# Altium schematic sheet FTDI.SchDoc
size Letter; CompanyName: UVM AERO; Organization: UVM AERO; Address1: 33 Colchester Ave; Address2: Votey 118; Address3: Philadelpia, PA 19104; Address4: USA
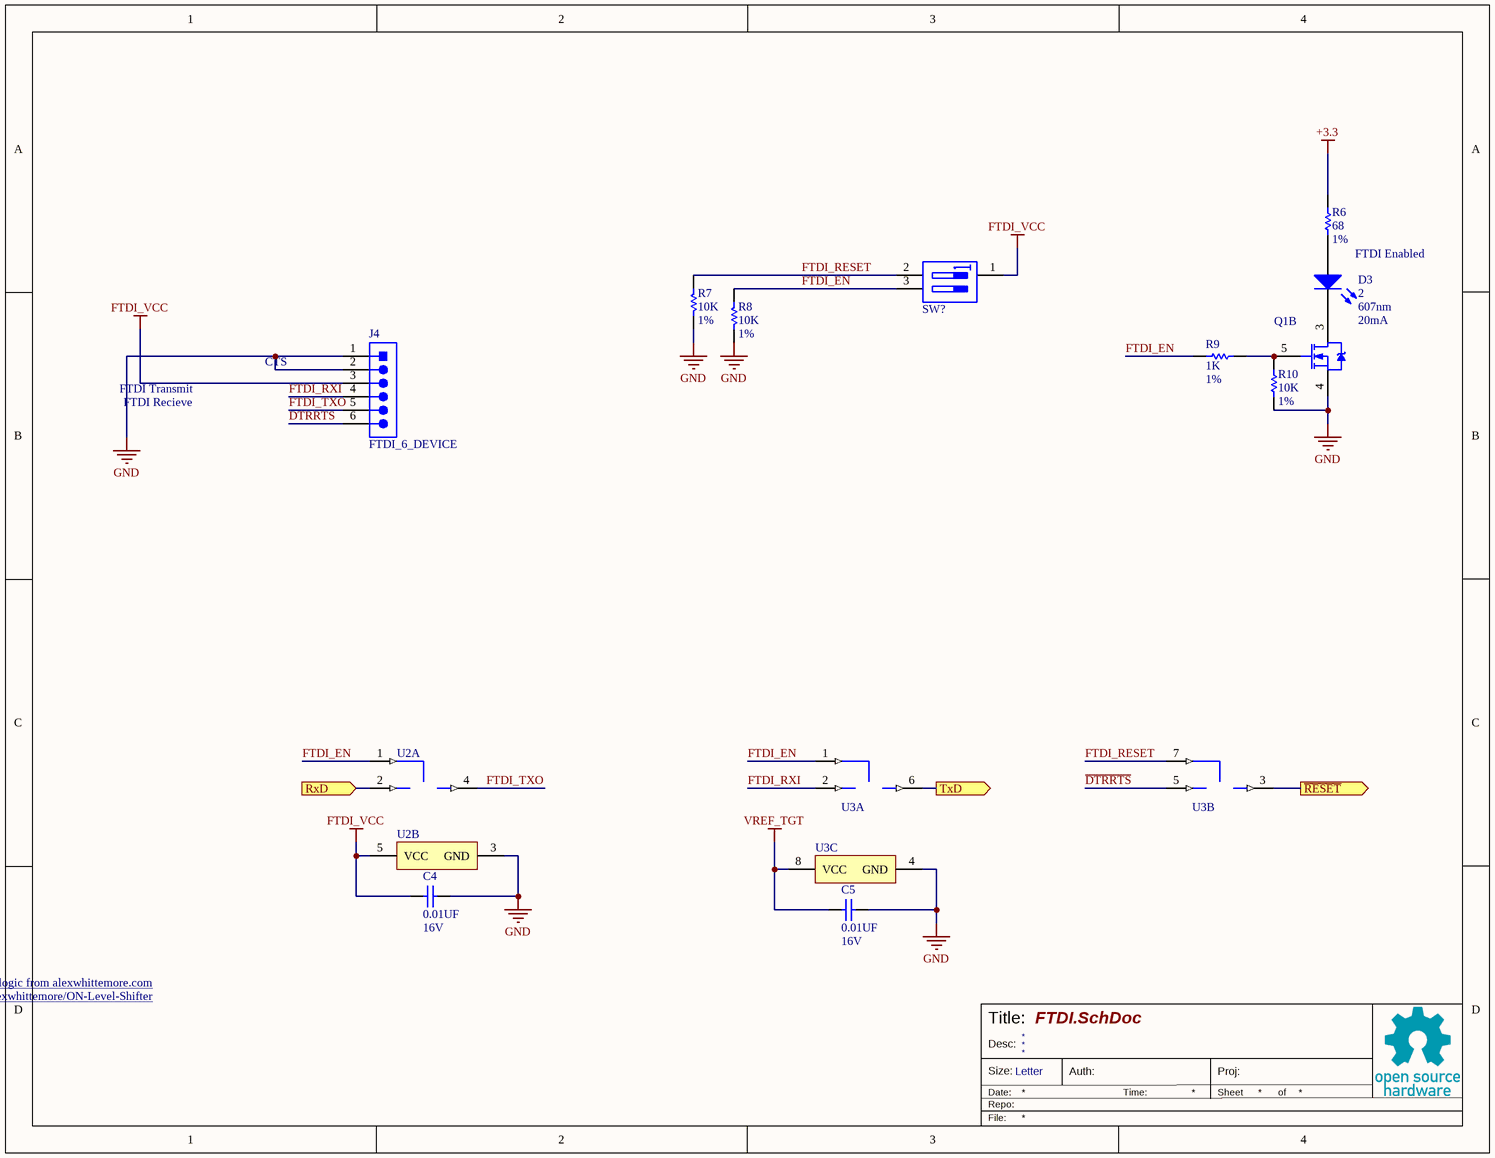
[diagram p0: FTDI.SchDoc]

## Parts
C4  Val: 0.01UF  Vol: 16V  [0603_CAP]  (hidden comment: CAP 0603 0.01UF 16V 10% X7R)
C5  Val: 0.01UF  Vol: 16V  [0603_CAP]  (hidden comment: CAP 0603 0.01UF 16V 10% X7R)
D3  Voltage Rating: 2  Wavelength: 607nm  Test Current: 20mA  [SM0805AC]  (hidden comment: Amber LED)
J4  FTDI_6_DEVICE  [FTDI_6_HDR_TTL-232R]
Q1  Dual N-Ch MOSFET  [SOT363]  (value not drawn)  (part B of 2)
R6  Val: 68  Tol: 1%  [0603_RES]  (hidden comment: RES 0603 68 1%)
R7  Val: 10K  Tol: 1%  [0603_RES]  (hidden comment: RES 0603 10K 1%)
R8  Val: 10K  Tol: 1%  [0603_RES]  (hidden comment: RES 0603 10K 1%)
R9  Val: 1K  Tol: 1%  [0603_RES]  (hidden comment: RES 0603 1K 1%)
R10  Val: 10K  Tol: 1%  [0603_RES]  (hidden comment: RES 0603 10K 1%)
SW?  SWITCH SLIDE DIP SPST 10MA 20V  [SPA02B]  (value not drawn)
U2  Buffer  [SOT353]  (value not drawn)  (parts A,B of 2)
U3  Dual Bus Buffer Gate  [DCU-8]  (value not drawn)  (parts A,B,C of 3)

## Ports
RxD (in), TxD (out), ~{RESET} (out)

## Nets
+3.3: R6.2
FTDI_VCC: C4.2 J4.3(VCC) SW?.1(C) U2.5(VCC)
GND: C4.1 C5.1 J4.1(GND) J4.2(~{CTS_(GND_if_unused)}) Q1.4(S) R7.1 R8.1 R10.1 U2.3(GND) U3.4(GND)
VREF_TGT: C5.2 U3.8(VCC)
~{DTRRTS}: J4.6(RTS_or~{_}DTR_(Often_used_for~{_}RESET)) U3.5(IN2)
~{RESET}: U3.3(OUT2) ; port ~{RESET}
FTDI_EN: R8.2 R9.1 SW?.3(B1) U2.1(EN) U3.1(EN1)
FTDI_RESET: R7.2 SW?.2(A1) U3.7(EN2)
FTDI_RXI: J4.4(RxD) U3.2(IN1)
FTDI_TXO: J4.5(TxD) U2.4(OUT)
RxD: U2.2(IN) ; port RxD
TxD: U3.6(OUT1) ; port TxD
NetD3_A: D3.A R6.1
NetD3_K: D3.K Q1.3(D)
NetQ1_5: Q1.5(G) R9.2 R10.2

## Notes on the sheet
- FTDI Enabled
- CTS
- FTDI Transmit
- FTDI Recieve
- Level shifting logic from alexwhittemore.com <https://www.alexwhittemore.com/on-uart-level-shifter/>
- His Schematic is at github.com/alexwhittemore/ON-Level-Shifter <https://github.com/alexwhittemore/ON-Level-Shifter>
- Title:
- Desc:
- Size:
- Date:
- File:
- Repo:
- Letter
- Auth:
- Time:
- Sheet
- Proj:
- of

## Library data of the parts
C4 C5 = CAP 0603 0.01UF 16V 10% X7R: Capacitor Surface Mount 0603 Footprint 0.01UF 16V 10% Tolerance Ceramic X7R; Manufacturer: Various; PCB Package: 0603; Description in Visual: Cap SMT 0603 0.01UF 16V 10%  Cer X7R; P/N: CAP 0603 0.01UF 16V 10% X7R; Manufacturer P/N: Various; Value: 0.01UF; Voltage: 16V; Tolerance: 10%; Type: Ceramic X7R; ComponentLink1Description: Manufacturer Website; ComponentLink2Description: Component Datasheet; ComponentLink3Description: Octopart Link
D3 = SM0805AC: Amber 607nm LED Indication - Discrete 2V 0805 (2012 Metric); Manufacturer: Bivar; PCB Package: 0805; Configuration: Single; Lens Style: Square; Millicandela Rating: 6mcd; Viewing Angle: 130°; Lens Type: Clear; Package Class: Surface Mount; P/N: SM0805AC; Manufacturer P/N: SM0805AC; Description in Visual: Amber 607nm LED Indication - Discrete 2V 0805 (2012 Metric); Color: Amber; ComponentLink1Description: Manufacturer Website; ComponentLink1URL: #https://www.bivar.com/#; ComponentLink2Description: Component Datasheet; ComponentLink2URL: https://www.bivar.com/parts_content/Datasheets/SM0805AC.pdf; ComponentLink3Description: Octopart Link; ComponentLink3URL: #https://octopart.com/sm0805ac-bivar-5838577?r=sp#Specs
J4 = FTDI_TTL_6PIN: Connector Header Through Hole 6 position 0.100" (2.54mm); Manufacturer: Generic; Manufacturer P/N: Various; Number of Contacts: 6; Gender: Male; P/N: FTDI_TTL_6PIN; Description in Visual: Connector Header Through Hole 6 position 0.100" (2.54mm); Orientation: Vertical; Number of Rows: 1; Pitch: 0.100"; Contact Finish: Gold; ComponentLink1Description: Pinout Reference; ComponentLink1URL: https://www.ftdichip.com/Support/Documents/DataSheets/Cables/DS_TTL-232R_CABLES.pdf; ComponentLink2Description: Datasheet for Connector; ComponentLink2URL: http://www.adam-tech.com/downloader.php?p=PH1-XX-UA.pdf; Supplier 1: Digi-Key; Supplier Part Number 1: 2057-PH1-06-UA-ND; Supplier 2: Digi-Key; Supplier Part Number 2: 732-5319-ND
Q1 = 2N7002DW: Dual N-Channel Enhancement Mode FET SOT-363; Manufacturer: Fairchild Semiconductors; Description in Visual: MOSFET Array SMT Dual N-Ch SOT-363; VDSS (V): 60; VDGR (V): 60.00; VGSS (V): +/-20; ID (mA): 115; P/N: 2N7002DW; Manufacturer P/N: 2N7002DW; Configuration: Dual N-Channel; PCB Package: SOT-363; ComponentLink1Description: Manufacturer Website; ComponentLink1URL: http://www.fairchildsemi.com; ComponentLink2Description: Component Datasheet; ComponentLink2URL: http://www.fairchildsemi.com/ds/2N%2F2N7002DW.pdf; ComponentLink3Description: Octopart Link; ComponentLink3URL: http://octopart.com/partsearch/#search/requestData&q=2N7002DW
R6 = RES 0603 68 1%: Resistor Surface Mount, 68 Ohms, 0603 Footprint, 1% Tolerance 0.1W; Manufacturer: Various; PCB Package: 0603; Description in Visual: Res SMT 68 0603  1%  0.1W; Value: 68; P/N: RES 0603 68 1%; Manufacturer P/N: Various; Power_Rating: 0.1W; Tolerance: 1%
R7 R8 R10 = RES 0603 10K 1%: Resistor Surface Mount, 10K Ohms, 0603 Footprint, 1% Tolerance 0.1W; Manufacturer: Various; PCB Package: 0603; Description in Visual: Res SMT 10K 0603  1%  0.1W; P/N: RES 0603 10K 1%; Manufacturer P/N: Various; Value: 10K; Power_Rating: 0.1W; Tolerance: 1%; Supplier 1: Digi-Key; Supplier Part Number 1: P10.0KHCT-ND; Supplier 2: Digi-Key; Supplier Part Number 2: 541-10.0KHCT-ND; Supplier 3: Newark; Supplier Part Number 3: 68R0128; Supplier 4: Digi-Key; Supplier Part Number 4: A106048CT-ND
R9 = RES 0603 1K 1%: Resistor Surface Mount, 1K Ohms, 0603 Footprint, 1% Tolerance 0.1W; Manufacturer: Various; PCB Package: 0603; Description in Visual: Res SMT 1K 0603  1%  0.1W; P/N: RES 0603 1K 1%; Manufacturer P/N: Various; Value: 1K; Power_Rating: 0.1W; Tolerance: 1%; Supplier 1: Digi-Key; Supplier Part Number 1: 2019-RK73H1JTTD1001FCT-ND; Supplier 2: Digi-Key; Supplier Part Number 2: 541-1166-1-ND; Supplier 3: RSComponents; Supplier Part Number 3: 1051155; Supplier 4: Digi-Key; Supplier Part Number 4: 311-1.00KHRCT-ND
SW? = SPA02B: Dip Switch SPST 2 Position Through Hole Slide (Standard) Actuator 10mA 20VDC, Commoned; Manufacturer: C&K; Number of Switches: 2; Mechanical Life: 1,000 Cycles; Throw Configuration: 2xSPST; Switch Function: Off-On (Common); Actuator Height: Flush/Recessed; P/N: SPA02B; Manufacturer Part Number: SPA02B; Type: DIP; Rated Current (A): 10mA; Rated Voltage (V): 20VDC; Temperature Range: -30°C ~ 60°C; Mounting Style: Through Hole; Electrical Life: 1,000 Cycles; Contact Material: Beryllium Copper. Gold Finish; ComponentLink1Description: Manufacturer's Website; ComponentLink1URL: https://www.ckswitches.com/; ComponentLink2Description: Component Datasheet; ComponentLink2URL: https://www.ckswitches.com/media/1325/spa.pdf; ComponentLink4Description: Octopart Link; ComponentLink4URL: https://octopart.com/spa02b-c%26k+components-7950389?r=sp; Supplier 1: Digi-Key; Supplier Part Number 1: CKN9438-ND
U2 = M74VHC1GT126: Buffer, Non-Inverting 1 Element 1 Bit per Element 3-State Output SC-88A (SC-70-5/SOT-353); Manufacturer: On Semiconductor; Manufacturer P/N: M74VHC1GT126DF1G; Description in Visual: IC BUFFER NON-INVERT 5.5V SC88A; Number of Gates: 1; Vs (min) (V): 3.3; Vs (max) (V): 5.5; Temp Range: -55°C ~ 125°C (TA); P/N: M74VHC1GT126; Type: Buffer; Number of Channels: 1; Number of Inputs: 1; PCB Package: SC-88A (SC-70-5/SOT-353); ComponentLink1Description: Manufacturer Website; ComponentLink1URL: #https://www.onsemi.com/#; ComponentLink2Description: Component Datasheet; ComponentLink2URL: https://www.onsemi.com/pub/Collateral/MC74VHC1GT126-D.PDF; ComponentLink3Description: Octopart Link; ComponentLink3URL: #https://octopart.com/m74vhc1gt125df2g-on+semiconductor-425358?r=sp#; Supplier 1: Digi-Key; Supplier Part Number 1: M74VHC1GT126DF1GOSCT-ND
U3 = SN74LVC2G126: Dual Bus Buffer Gate with 3-state outputs VSSOP-8; Manufacturer: Texas Instruments; Manufacturer P/N: SN74LVC2G126DCU; Description in Visual: Logic IC SMT Dual Buffer Gate VSSOP-8; Number of Gates: 2; Vs (min) (V): 1.65; Vs (max) (V): 5.5; Temp Range: -40 to +85 °C; P/N: SN74LVC2G126; Type: Buffer; Number of Gate Inputs: 2; PCB Package: VSSOP-8; ComponentLink1Description: Manufacturer Website; ComponentLink1URL: http://www.ti.com; ComponentLink2Description: Component Datasheet; ComponentLink2URL: http://www.ti.com/lit/ds/symlink/sn74lvc2g126.pdf?HQS=TI-null-null-digikeymode-df-pf-null-wwe&ts=1591325427184; ComponentLink3Description: Octopart Link; ComponentLink3URL: #https://octopart.com/sn74lvc2g126dcut-texas+instruments-2328158?r=sp#; Supplier 1: Digi-Key; Supplier Part Number 1: 296-12555-1-ND; Supplier 2: Digi-Key; Supplier Part Number 2: 296-32321-1-ND